# EAGLE schematic final (EAGLE 7.7.0)
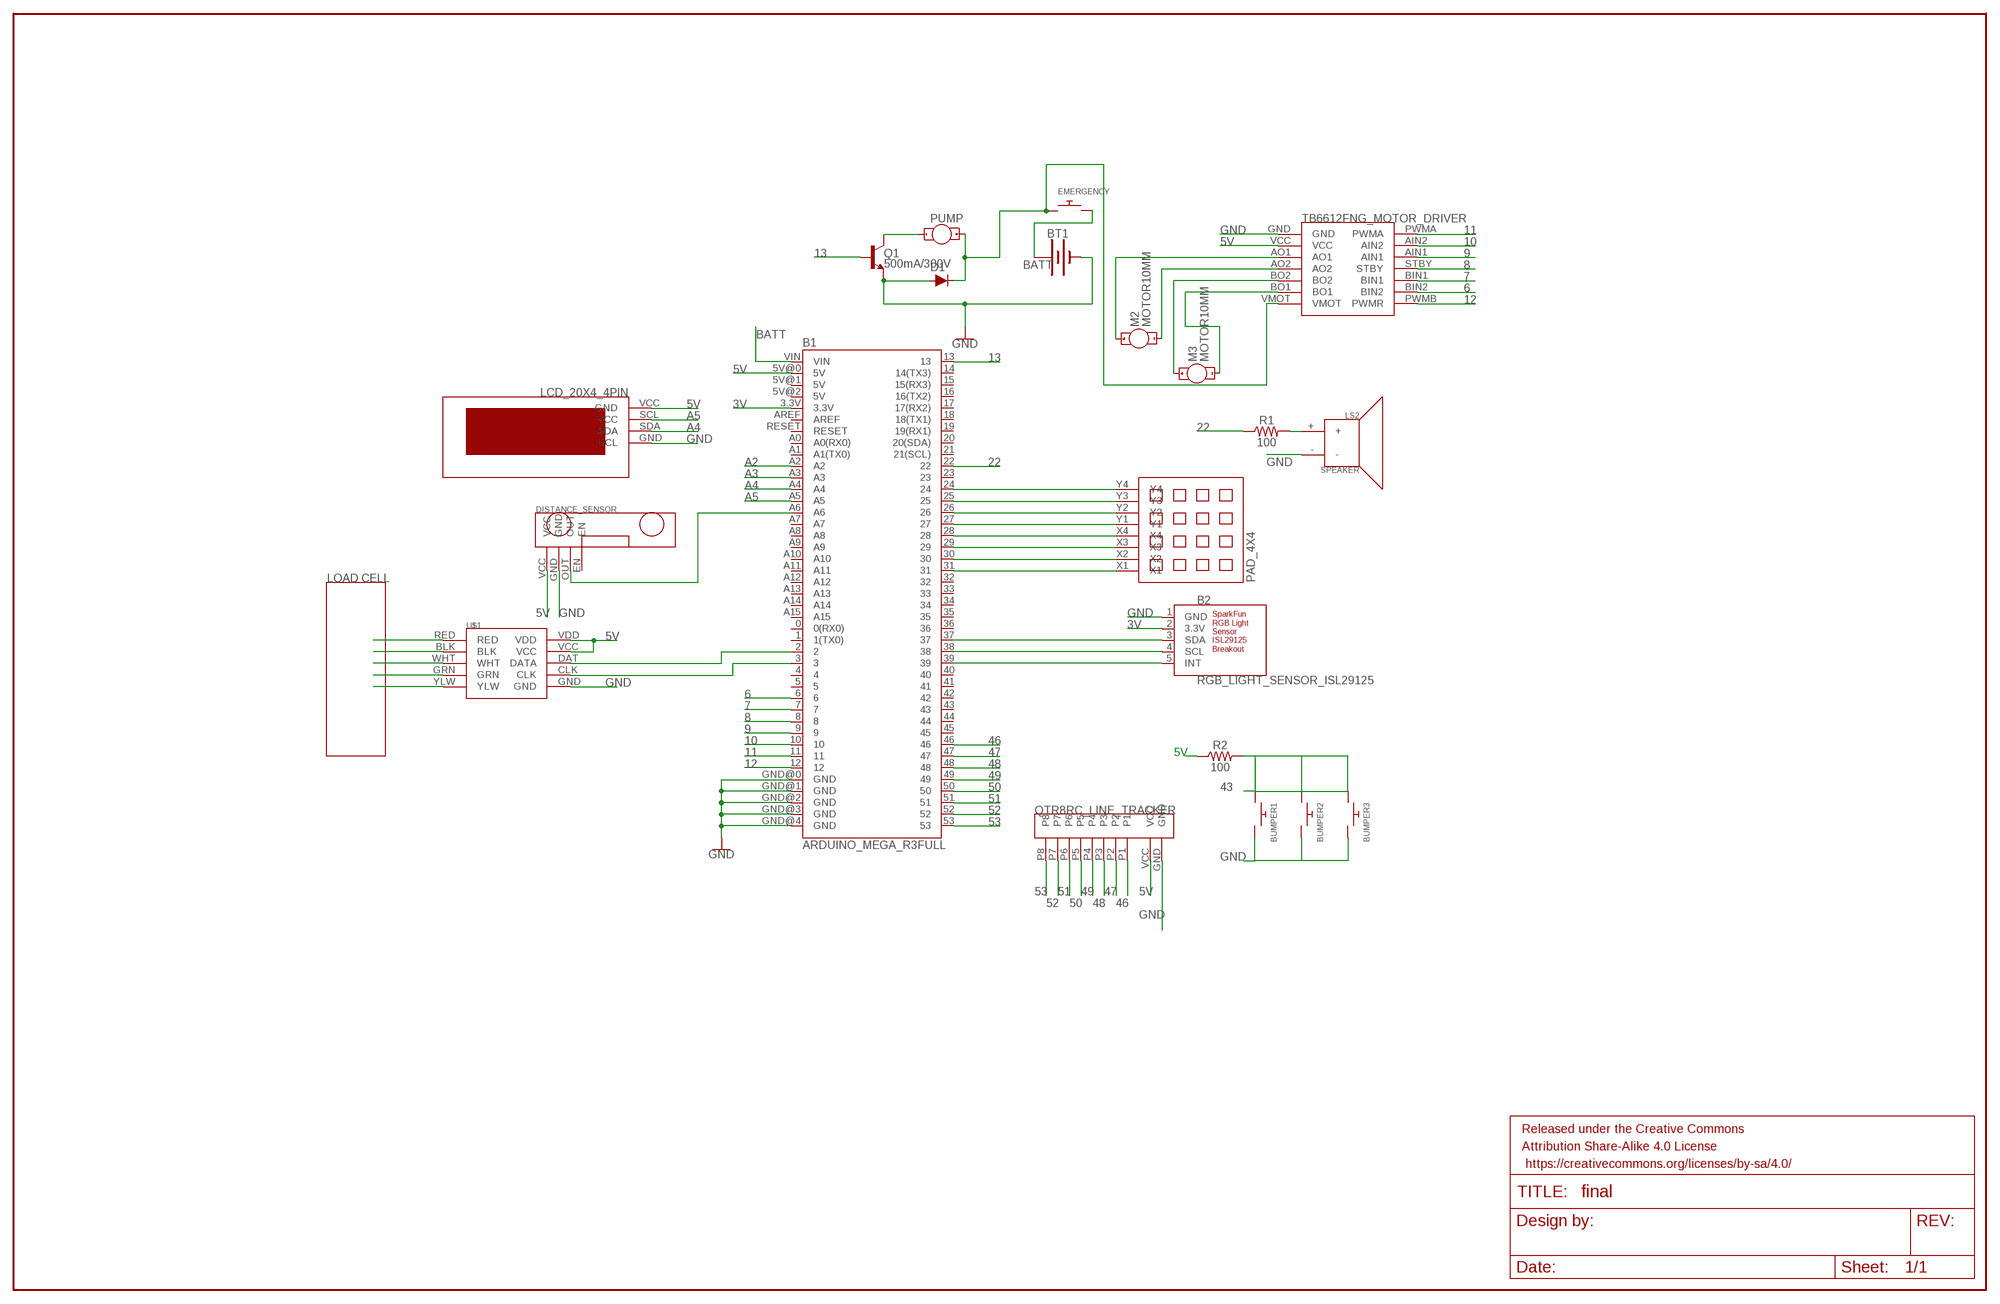
[diagram p0: schematic, sheet 1]

## Parts
B1  ARDUINO_MEGA_R3FULL  [ARDUINO_MEGA]
B2  RGB_LIGHT_SENSOR_ISL29125  [ISL29125]
BT1  BATTERY-12MM_SMD  [BATTCON_12MM]
BUMPER1  SWITCH_PUSHBUTTONSOFTTOUCHSMD_SJ  [PUSHBUTTON_SMD_SJ]
BUMPER2  SWITCH_PUSHBUTTONSOFTTOUCHSMD_SJ  [PUSHBUTTON_SMD_SJ]
BUMPER3  SWITCH_PUSHBUTTONSOFTTOUCHSMD_SJ  [PUSHBUTTON_SMD_SJ]
D1  DIODE-PTH  [DIODE-1N4001]
DISTANCE_SENSOR  SHARP_DISTANCE  [SHARP_DISTANCE]
EMERGENCY  SWITCH_PUSHBUTTONSOFTTOUCHSMD_SJ  [PUSHBUTTON_SMD_SJ]
FRAME2  FRAME-LEDGER  [CREATIVE_COMMONS]
LCD_20X4_4PIN  LCD_20X4_4PIN  [LCD_20X4_4PIN]
LS2  SPEAKER  [PCB_MOUNT_SPEAKER]
M2  MOTOR10MM  [VIBE-MOTOR-10MM]
M3  MOTOR10MM  [VIBE-MOTOR-10MM]
PAD_4X4  PAD_4X4  [PAD_4X4]
PUMP  MOTOR10MM  [VIBE-MOTOR-10MM]
Q1  500mA/300V  TRANS_NPN-MMBTA42  [SOT23-3]
QTR8RC_LINE_TRACKER  QTR-8RC_LINE_TRACKER  [QTR_8RC_LINE_TRACKER]
R1  100  100OHM-HORIZ_KIT-1/4W-1%  [AXIAL-0.3EZ]
R2  100  100OHM-HORIZ_KIT-1/4W-1%  [AXIAL-0.3EZ]
TB6612FNG_MOTOR_DRIVER  TB6612FNG_MOTOR_CARRIER  [TB6612FNG_MOTOR_CARRIER]
U$1  HX711_CARRIER  [HX711_CARRIER]

## Nets
3V: B1.3.3V B2.2(3.3V)
5V: B1.5V@0(5V) DISTANCE_SENSOR.VCC LCD_20X4_4PIN.VCC(GND) QTR8RC_LINE_TRACKER.VCC R2.P$1 TB6612FNG_MOTOR_DRIVER.VCC U$1.VCC U$1.VDD
6: B1.6 TB6612FNG_MOTOR_DRIVER.BIN2
7: B1.7 TB6612FNG_MOTOR_DRIVER.BIN1
8: B1.8 TB6612FNG_MOTOR_DRIVER.STBY
9: B1.9 TB6612FNG_MOTOR_DRIVER.AIN1
10: B1.10 TB6612FNG_MOTOR_DRIVER.AIN2
11: B1.11 TB6612FNG_MOTOR_DRIVER.PWMA
12: B1.12 TB6612FNG_MOTOR_DRIVER.PWMB(PWMR)
13: B1.13 Q1.1(B)
22: B1.22 R1.P$1
43: BUMPER1.P$1 BUMPER2.P$1 BUMPER3.P$1 R2.P$2
46: B1.46 QTR8RC_LINE_TRACKER.P1
47: B1.47 QTR8RC_LINE_TRACKER.P2
48: B1.48 QTR8RC_LINE_TRACKER.P3
49: B1.49 QTR8RC_LINE_TRACKER.P4
50: B1.50 QTR8RC_LINE_TRACKER.P5
51: B1.51 QTR8RC_LINE_TRACKER.P6
52: B1.52 QTR8RC_LINE_TRACKER.P7
53: B1.53 QTR8RC_LINE_TRACKER.P8
A2: B1.A2
A3: B1.A3
A4: B1.A4 LCD_20X4_4PIN.SDA
A5: B1.A5 LCD_20X4_4PIN.SCL(VCC)
BATT: B1.VIN BT1.PWR@1(+) EMERGENCY.P$2
GND: B1.GND@0(GND) B1.GND@1(GND) B1.GND@2(GND) B1.GND@3(GND) B1.GND@4(GND) B2.1(GND) BT1.GND(-) BUMPER1.P$2 BUMPER2.P$2 BUMPER3.P$2 D1.A DISTANCE_SENSOR.GND LCD_20X4_4PIN.GND(SCL) LS2.- Q1.2(E) QTR8RC_LINE_TRACKER.GND TB6612FNG_MOTOR_DRIVER.GND U$1.GND
N$1: PUMP.- Q1.3(C)
N$2: LS2.+ R1.P$2
N$3: B1.24 PAD_4X4.Y4
N$4: B1.25 PAD_4X4.Y3
N$5: M2.+ TB6612FNG_MOTOR_DRIVER.AO1
N$6: M2.- TB6612FNG_MOTOR_DRIVER.AO2
N$7: M3.+ TB6612FNG_MOTOR_DRIVER.BO2
N$9: M3.- TB6612FNG_MOTOR_DRIVER.BO1
N$10: B1.26 PAD_4X4.Y2
N$11: B1.27 PAD_4X4.Y1
N$12: B1.28 PAD_4X4.X4
N$13: B1.29 PAD_4X4.X3
N$14: B1.30 PAD_4X4.X2
N$15: B1.31 PAD_4X4.X1
N$16: D1.C EMERGENCY.P$1 PUMP.+ TB6612FNG_MOTOR_DRIVER.VMOT
N$17: U$1.RED
N$18: B1.37 B2.3(SDA)
N$19: B1.38 B2.4(SCL)
N$20: B1.39 B2.5(INT)
N$21: B1.A6 DISTANCE_SENSOR.OUT
N$22: U$1.BLK
N$23: B1.2 U$1.DAT(DATA)
N$24: B1.3 U$1.CLK
N$25: U$1.WHT
N$26: U$1.GRN
N$27: U$1.YLW
Unconnected: B1.0(0(RX0)) B1.1(1(TX0)) B1.4 B1.5 B1.5V@1(5V) B1.5V@2(5V) B1.14(14(TX3)) B1.15(15(RX3)) B1.16(16(TX2)) B1.17(17(RX2)) B1.18(18(TX1)) B1.19(19(RX1)) B1.20(20(SDA)) B1.21(21(SCL)) B1.23 B1.32 B1.33 B1.34 B1.35 B1.36 B1.40 B1.41 B1.42 B1.43 B1.44 B1.45 B1.A0(A0(RX0)) B1.A1(A1(TX0)) B1.A7 B1.A8 B1.A9 B1.A10 B1.A11 B1.A12 B1.A13 B1.A14 B1.A15 B1.AREF B1.RESET DISTANCE_SENSOR.EN

## Notes on the sheet
- LOAD CELL

## Library data of the parts
B1 = SparkFun-Boards:ARDUINO_MEGA_R3: Arduino Mega R3 ATmega2560 R3 compatible footprint. SparkFun Products: Arduino Mega 2560 R3 <https://www.sparkfun.com/products/11061>
B2 = SparkFun-Boards:RGB_LIGHT_SENSOR_ISL29125: SparkFun RGB Light Sensor - ISL29125 Mechanical footprint with connectors for ISL29125 RGB Light Sensor Breakout. SparkFun Products: SparkFun RGB Light Sensor - ISL29125 <https://www.sparkfun.com/products/12829>
BT1 = SparkFun-Batteries:BATTERY: Battery - Single Cell A variety of battery chemistries, sizes, and footprints. Device List: 20MM_PTH - Coin Cell Battery Holder - 20mm (PTH) <https://www.sparkfun.com/products/783> 6.8MM_PTH - Coin Cell Battery Holder - 6.8MM(SMD) <https://www.digikey.com/product-detail/en/seiko-instruments/MS621FE-FL11E/728-1057-ND/1889208?WT.srch=1&gclid=CNOQ5a6LzdQCFZS2wAodXCkE0g> 12MM_SMD - Coin Cell Battery Holder - 12mm (SMD) <https://www.sparkfun.com/products/10592> 12MM_PTH - Coin Cell Battery Holder - 12mm (PTH) <https://www.sparkfun.com/products/7948> 20MM_SMD - 20mm Coin Cell Battery Holder (SMD) (2 legs) Used on the Big Time Watch Kit <https://www.sparkfun.com/products/11734> 20MM_SMD_4LEGS - Coin Cell Battery Holder - 20mm (SMD) <https://www.sparkfun.com/products/11892> 20MM_SMD_4LEGS_OVERPASTE - Coin Cell Battery Holder - 20mm (SMD) <https://www.sparkfun.com/products/11892> (Over-paste on the legs) 24.5MM_PTH - Coin Cell Battery Holder - 24.5mm (PTH) <https://www.sparkfun.com/products/8863> 9V - 9V Battery Holder - PC Mount Used on the SparkFun SparkPunk Sound Kit <https://www.sparkfun.com/products/11177> and SparkFun SparkPunk Sequencer Kit <https://www.sparkfun.com/products/12707> 18650 - Battery Holder - 18650 (PTH) <https://www.sparkfun.com/products/13113> AA - Battery Holder - 1xAA (PTH) <https://www.sparkfun.com/products/7949> AAA - Battery Holder - 1xAAA (PTH) <https://www.sparkfun.com/products/12718> AA_KIT - Battery Holder - 1xAA (PTH) <https://www.sparkfun.com/products/7949> Special kit package - pads only have exposed copper on one side of the board. AAA_KIT - Battery Holder - 1xAAA (PTH) <https://www.sparkfun.com/products/12718> Special kit package - pads only have exposed copper on one side of the board.; PROD_ID: BATT-08044; SF_SKU: PRT-10592
BUMPER1-BUMPER3 EMERGENCY = adafruit:SWITCH_PUSHBUTTON: Buttons SOFTTOUCHSMD_SJ - Soft touch temporary push button (Super Junk Akihabara) Compatible with SKPMANE010 [Mouser: 688-SKPMAN] C&K_KSS = Digikey: KSS221GLFS
D1 = SparkFun-DiscreteSemi:DIODE: Diode These are standard reverse protection diodes and small signal diodes. SparkFun Products: SparkFun SparkPunk Sound Kit <https://www.sparkfun.com/products/11177> SparkFun ESP8266 Thing <https://www.sparkfun.com/products/13231>; PROD_ID: DIO-09176; VALUE: 1A/50V/1.1V
DISTANCE_SENSOR = custom:SHARP_DISTANCE
FRAME2 = SparkFun-Aesthetics:FRAME-LEDGER: Schematic Frame - Ledger Standard 11x14 US Ledger frame
LCD_20X4_4PIN = custom:LCD_20X4_4PIN
LS2 = SparkFun-Electromechanical:SPEAKER: Speaker Generic 2-terminal loudspeakers SparkFun Products Speaker - PCB Mount <https://www.sparkfun.com/products/11089> (COM-11089); PROD_ID: COMP-11789; SF_SKU: COM-11089
M2 M3 PUMP = SparkFun-Electromechanical:MOTOR: Motor (Single-Phase) Two-terminal, single-phase motors. SparkFun Products Vibration Motor <https://www.sparkfun.com/products/8449> (ROB-08449) Physical dimension and wire connections for this powerful vibration motor. Motor has a self adhesive backing.; PROD_ID: COMP-08572; SF_SKU: ROB-08449
PAD_4X4 = custom:PAD_4X4
Q1 = SparkFun-DiscreteSemi:TRANS_NPN: NPN transistor Current controlled devices typically used to amplify current or used as a switch. BC547 - COM-08928 <http://www.sparkfun.com/products/8928> (TO-92 45V 100mA) (1.Collector 2.Base 3.Emitter) 2N3904 - COM-00521 <http://www.sparkfun.com/products/521> (TO-92 40V 200mA) (1.Emitter 2.Base 3.Collector) P2N2222A - COM-12852 <http://www.sparkfun.com/products/12852> (TO-92 40V 600mA) (1.Collector 2.Base 3.Emitter); PROD_ID: TRANS-09116
QTR8RC_LINE_TRACKER = custom:QTR-8RC_LINE_TRACKER
R1 R2 = SparkFun-Resistors:100OHM: 100Ω resistor A resistor is a passive two-terminal electrical component that implements electrical resistance as a circuit element. Resistors act to reduce current flow, and, at the same time, act to lower voltage levels within circuits. - Wikipedia; PROD_ID: RES-12181
TB6612FNG_MOTOR_DRIVER = custom:TB6612FNG_MOTOR_CARRIER
U$1 = custom:HX711_CARRIER

## Module WAF
Ports: 

### Library data of the parts